# EAGLE design RS-485-Interface-Unit (EAGLE 9.6.2)
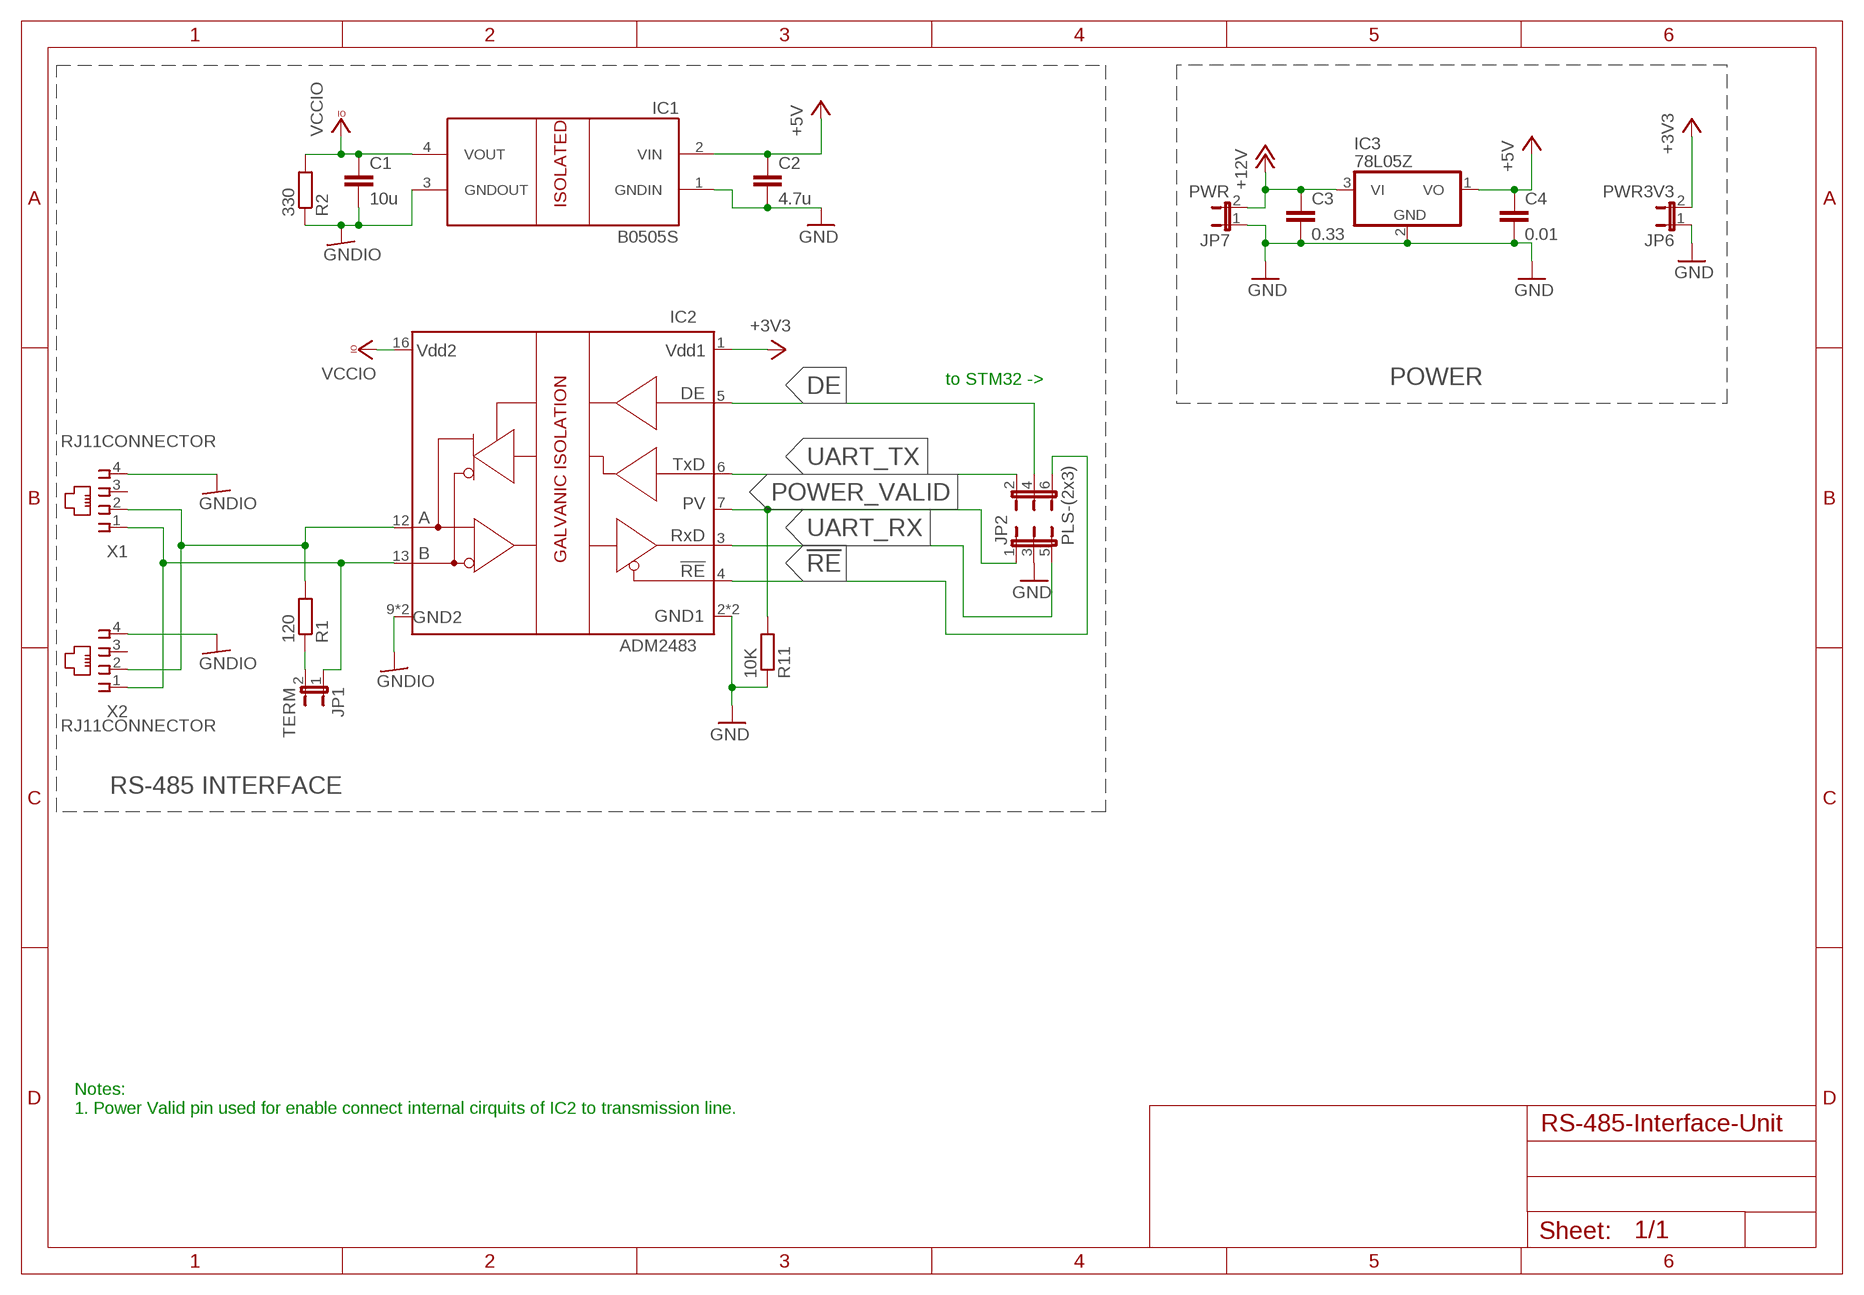
[diagram p0: schematic, sheet 1]

## Parts
C1  10u  C-EUC0805  [C0805]
C2  4.7u  C-EUC0805  [C0805]
C3  0.33  C-EUC2012  [C2012]
C4  0.01  C-EUC2012  [C2012]
IC1  B0505S  [SC_PACKAGE]
IC2  ADM2483  [SO16W]
IC3  78L05Z  [TO92]
JP1  TERM  JP1E  [JP1]
JP2  PLS-(2х3)  [PLS-(2х3)]
JP6  PWR3V3  JP1E  [JP1]
JP7  PWR  JP1E  [JP1]
R1  120  R-EU_0204/7  [0204/7]
R2  330  R-EU_R0805  [R0805]
R11  10K  R-EU_R0805  [R0805]
X1  RJ11CONNECTOR  [RJ11_NONAME]
X2  RJ11CONNECTOR  [RJ11_NONAME]

## Nets
!RE: IC2.4(!RE) JP2.6
+3V3: IC2.1(VDD1) JP6.2
+5V: C2.1 C4.1 IC1.2(VIN) IC3.1(VO)
+12V: C3.1 IC3.3(VI) JP7.2
A-IN: IC2.12(A) R1.2 X1.2 X2.2
B-IN: IC2.13(B) JP1.1 X1.1 X2.1
DE: IC2.5(DE) JP2.4
GND: C2.2 C3.2 C4.2 IC1.1(GNDIN) IC2.2(GND1) IC2.8(GND1) IC3.2(GND) JP2.3 JP6.1 JP7.1 R11.1
GNDIO: C1.2 IC1.3(GNDOUT) IC2.9(GND2) IC2.15(GND2) R2.1 X1.4 X2.4
N$3: JP1.2 R1.1
POWER_VALID: IC2.7(PV) JP2.1 R11.2
UART_RX: IC2.3(RXD) JP2.5
UART_TX: IC2.6(TXD) JP2.2
VCCIO: C1.1 IC1.4(VOUT) IC2.16(VDD2) R2.2
Unconnected: X1.3 X2.3

## Notes on the sheet
- to STM32 -> | POWER
- RS-485 INTERFACE
- Notes:
  1. Power Valid pin used for enable connect internal cirquits of IC2 to transmission line.

## Library data of the parts
C1-C4 = rcl:C-EU: CAPACITOR, European symbol; SPICEPREFIX: C
IC1 = veres:B0505S
IC2 = veres:ADM2483
IC3 = linear:78*: Positive VOLTAGE REGULATOR Source: http://cache.national.com/ds/LM/LM78L05.pdf http://www.fairchildsemi.com/ds/LM/LM7805.pdf
JP1 JP6 JP7 = jumper:JP1E: JUMPER
JP2 = jumper:PLS-(2х3)
R1 R2 R11 = rcl:R-EU_: RESISTOR, European symbol; SPICEPREFIX: R
X1 X2 = veres:RJ11CONNECTOR: RJ11 Connector Source: 4UCON TECHNOLOGY INC. 14867.pdf; OC_FARNELL: unknown; OC_NEWARK: unknown

## Board
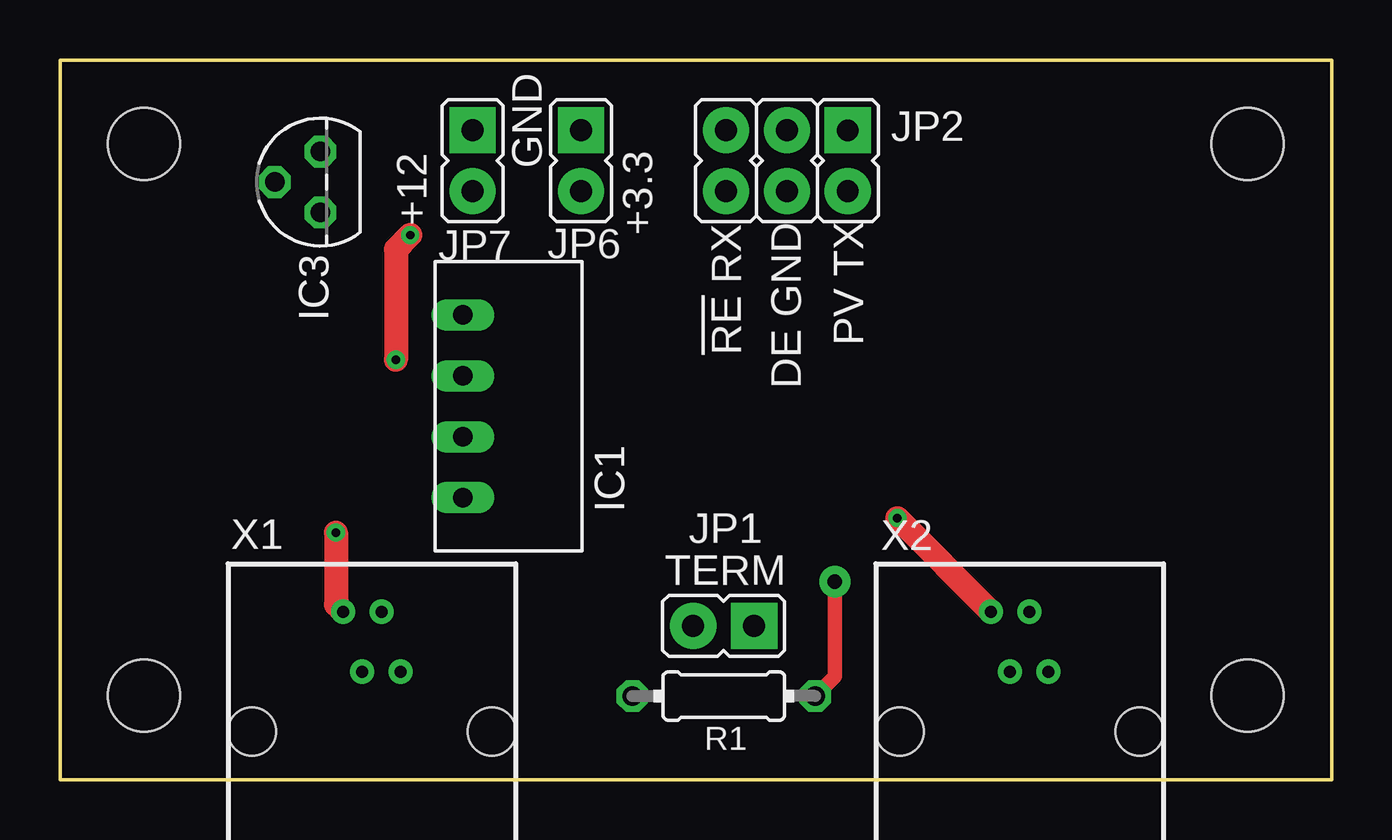
[diagram p1: board, top side]
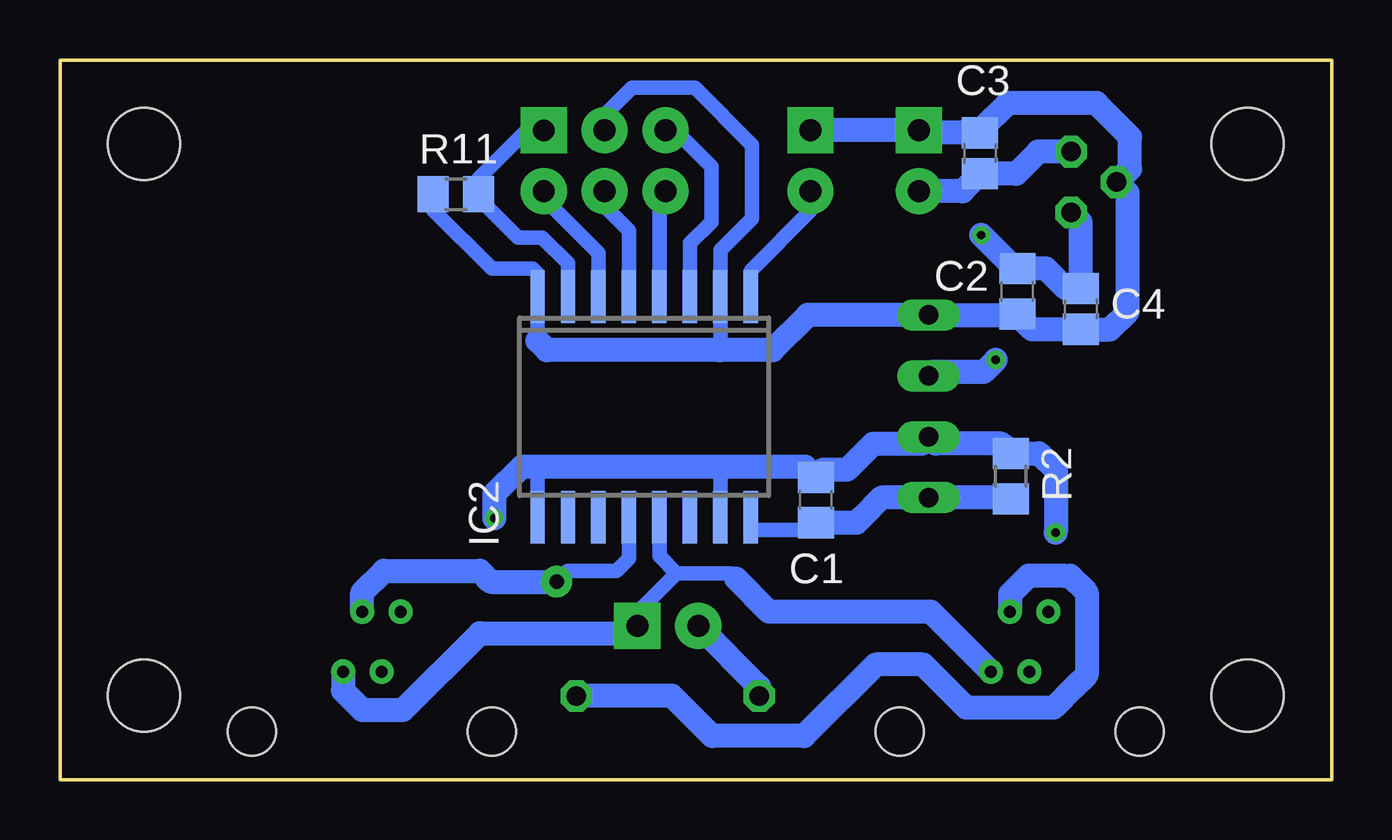
[diagram p2: board, bottom side, seen from below]

Size 53 x 30 mm. Coordinates in mm from the lower left corner, seen from the top.
Outline: 0,30 53,30 53,0 0,0 0,30
Copper layers (1*16): Top 0.035mm / dielectric 1mm / Bottom 0.035mm
Design rules "default *": minimum track width 6mil, minimum drill 0.35mm, track to track 0.5mm, track to pad 0.5mm, pad to pad 0.5mm, via to via 0.5mm, smd to smd 6mil, copper to edge 0.3mm, drill to drill 6mil, minimum pad ring 10mil, minimum via ring 8mil, stop-mask expansion 4mil, vias tented up to drill 0mil, thermal gap 10mil
Holes 3 mm at 49.5,3.5 49.5,26.5 3.5,3.5 3.5,26.5
tRestrict: area -0.3,14.7 to 52.7,16.4
bRestrict: area -0.3,14.7 to 52.7,16.4

### Footprints (pad centres in the part's own frame; a part is rotated, then mirrored left to right if it is on the bottom)
C0805 = smd 1.3 x 1.5: 1 -0.95,0; 2 0.95,0
C2012 = smd 1.3 x 1.5: 1 -0.85,0; 2 0.85,0
SC_PACKAGE = drill 0.813 long: 1 -3.81,-2.54; 2 -1.27,-2.54; 3 1.27,-2.54; 4 3.81,-2.54
SO16W = smd 0.6 x 2.2: 1 -4.445,-4.6; 2 -3.175,-4.6; 3 -1.905,-4.6; 4 -0.635,-4.6; 5 0.635,-4.6; 6 1.905,-4.6; 7 3.175,-4.6; 8 4.445,-4.6; 9 4.445,4.6; 10 3.175,4.6; 11 1.905,4.6; 12 0.635,4.6; 13 -0.635,4.6; 14 -1.905,4.6; 15 -3.175,4.6; 16 -4.445,4.6
TO92 = drill 0.813 octagon: 1 -1.27,0; 2 0,1.905; 3 1.27,0
JP1 = drill 0.914 pad 1.93 square: 1 0,-1.27 | drill 0.914 pad 1.93: 2 0,1.27
PLS-(2х3) = drill 0.9 pad 1.93 square: 1 -2.54,-1.27 | drill 0.9 pad 1.93: 2 -2.54,1.27 | drill 0.914 pad 1.93: 3 0,-1.27; 4 0,1.27; 5 2.54,-1.27; 6 2.54,1.27
0204/7 = drill 0.813 octagon: 1 -3.81,0; 2 3.81,0
R0805 = smd 1.3 x 1.5: 1 -0.95,0; 2 0.95,0
RJ11_NONAME = drill 0.5 pad 1: 1 1.2,2.5; 2 0.4,5; 3 -0.4,2.5; 4 -1.2,5 | hole 2: -5,0; 5,0

### Placement (x,y rotation side)
C1  21.5,11.66 90 bottom
C2  13.1,20.36 270 bottom
C3  14.65,26.11 90 bottom
C4  10.45,19.62 270 bottom
IC1  19.33,15.56 270 top
IC2  28.65,15.54 180 bottom
IC3  10.86,24.91 90 top
JP1  27.66,6.4 90 top
JP2  30.3,25.8 180 top
JP6  21.72,25.8 180 top
JP7  17.2,25.8 180 top
R1  27.67,3.48 0 top
R2  13.37,12.65 270 bottom
R11  36.5,24.4 0 bottom
X1  13,2 0 top
X2  40,2 0 top

### Tracks (layer width: path | path; a pad name or v marks a point on that pad's centre or on a via)
!RE
  Bottom 0.6: JP2.6 28.02,24.27 IC2.4
+3V3
  Bottom 0.6: IC2.1 24.2,21.23 21.72,23.71 JP6.2
+5V  (via drill 0.35)
  Top 1: v14.6,22.7 14,22.1 v14,17.5
  Bottom 1: IC3.1 10.45,23.23 C4.1 11.07,20.47 11.91,21.31 C2.1 13.21,21.31 v14.6,22.7 | v14,17.5 14.5,17 16.62,17 IC1.2
+12V
  Bottom 1: IC3.3 12.22,26.18 13.14,25.26 C3.1 15.38,24.53 JP7.2
A-IN  (via drill 0.6 pad 1.3)
  Top 0.6: v32.3,8.25 32.3,4.3 R1.2
  Bottom 0.6: IC2.12 29.28,9.21 29.8,8.7 31.85,8.7 v32.3,8.25
  Bottom 1: X2.2 40.4,7.8 39.5,8.7 35.5,8.7 35.05,8.25 v32.3,8.25 | X1.2 13.4,7.72 12.62,8.5 11.18,8.5 11.17,8.5 10.9,8.5 10.2,7.8 10.2,4.37 10.74,3.84 11.58,3 15.22,3 17.03,4.8 19,4.8 21.98,1.82 25.82,1.82 27.5,3.5 31.46,3.5 R1.2
B-IN
  Bottom 0.6: 24.82,8.38 25.04,8.6 27.3,8.6 | IC2.13 28.02,9.31 27.3,8.6 | JP1.1 28.93,6.97 27.3,8.6
  Bottom 1: X2.1 41.2,3.7 40.4,2.9 38.7,2.9 35.5,6.1 29.24,6.1 JP1.1 | X1.1 16.7,7 23.44,7 24.82,8.38
DE
  Bottom 0.6: IC2.5 29.28,22.88 30.3,23.9 JP2.4
GND
  Bottom 0.6: R11.1 37.45,23.75 35,21.3 33.3,21.3 33.09,21.09 IC2.8 33.09,18.3 33.1,18.3 | 25.5,17.9 25.48,17.92 IC2.2 25.48,22.07 24.15,23.39 24.15,26.46 26.53,28.84 29.16,28.84 30.3,27.7 JP2.3
  Bottom 1: JP6.1 JP7.1 17.09,26.96 C3.2 14.65,27.05 13.5,28.2 9.8,28.2 8.4,26.8 8.4,25.46 IC3.2 8.5,24.45 8.5,19.5 9.23,18.77 C4.2 12.48,18.77 C2.2 13.14,19.37 IC1.1 19.7,19.37 | 19.7,19.37 19.9,19.37 21.83,19.37 23.3,17.9 25.5,17.9 32.7,17.9 33.1,18.3 | 19.7,19.37
GNDIO  (via drill 0.35)
  Top 1: X2.4 v34.9,10.9 | v11.5,10.3 11.5,7.3 X1.4
  Bottom 0.6: 16.5,14 IC1.3 | IC2.15 25.48,12.97 25.4,13.04 | IC2.9 33.09,12.95 33,13.04
  Bottom 1: 16.5,14 13.77,14 R2.1 12.2,13.6 11.5,12.9 v11.5,10.3 | IC1.3 17.08,14 19.11,14 20.2,12.91 21.2,12.91 C1.2 21.93,13.04 25.4,13.04 33,13.04 33.76,13.04 34.9,11.9 v34.9,10.9
N$3
  Bottom 1: JP1.2 23.86,3.87 R1.1
POWER_VALID
  Bottom 0.6: IC2.7 31.83,21.52 32.9,22.6 33.9,22.6 35.55,24.25 R11.2 35.55,25.05 33.53,27.07 JP2.1
UART_RX
  Bottom 0.6: IC2.3 26.74,22.35 25.85,23.25 25.85,25.55 27.37,27.07 JP2.5
UART_TX
  Bottom 0.6: IC2.6 30.55,21.95 32.84,24.24 JP2.2
VCCIO
  Bottom 0.6: IC2.16 24.2,10.4 21.8,10.4 C1.1 21.3,10.91 19.6,10.91
  Bottom 1: R2.2 13.42,11.75 IC1.4 18.76,11.75 19.6,10.91 19.8,10.71 C1.1

### Text on the board
tNames: GND | +12 | +3.3 | PV TX | !RE! RX | DE GND | TERM